# Altium project ActiveElectrod.PrjPcb
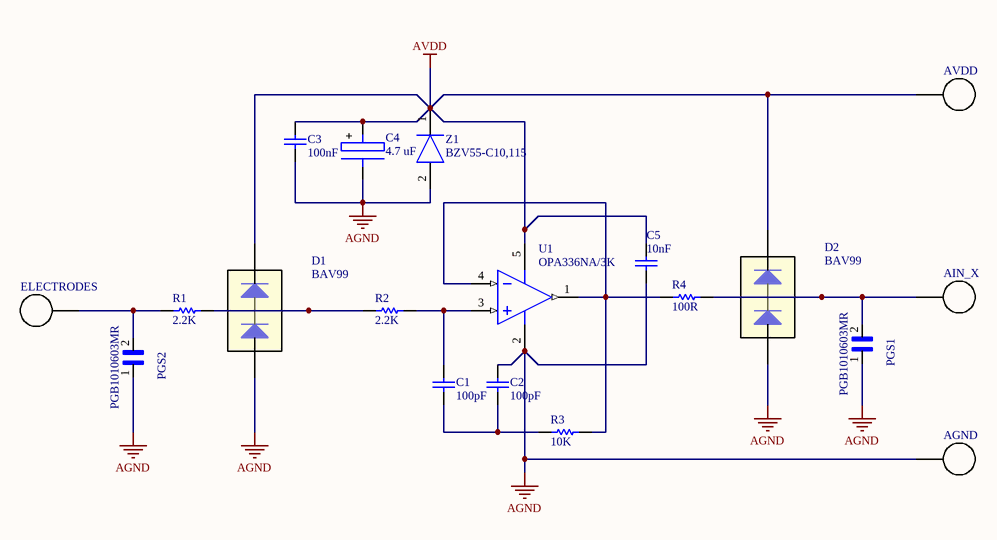
[diagram p0: ActiveElectrod.SchDoc]
1 sheet, 19 parts. Net scope: global (net labels, ports and power ports of the same name join across sheets).
Board file: ActiveElectrod.PcbDoc

## Sheet ActiveElectrod.SchDoc
size A

### Parts
AGND  Test Point 1  [Test Point]  (value not drawn)
AIN_X  Test Point 1  [Test Point]  (value not drawn)
AVDD  Test Point 1  [Test Point]  (value not drawn)
C1  value 100pF  [J1-0603]  (hidden comment: Cap Semi)
C2  value 100pF  [J1-0603]  (hidden comment: Cap Semi)
C3  value 100nF  [J1-0603]  (hidden comment: Cap Semi)
C4  value 4.7 uF  [3528 - Type B]  (hidden comment: Cap polar_Vishay Type B)
C5  value 10nF  [J1-0603]  (hidden comment: Cap Semi)
D1  BAV99  [SOT-23]
D2  BAV99  [SOT-23]
ELECTRODES  Test Point 1  [Test Point]  (value not drawn)
PGS1  PGB1010603MR  [*ESD_PGB1010603MR]
PGS2  PGB1010603MR  [*ESD_PGB1010603MR]
R1  value 2.2K  [J1-0603]  (hidden comment: Res1)
R2  value 2.2K  [J1-0603]  (hidden comment: Res1)
R3  value 10K  [J1-0603]  (hidden comment: Res1)
R4  value 100R  [J1-0603]  (hidden comment: Res1)
U1  OPA336NA/3K  [TI-DBV5_N]
Z1  BZV55-C10,115  [BZV55-C10]

### Nets
AGND: AGND.1 C2.1 C3.1 C4.2 C5.2 D1.1(A) D2.1(A) PGS1.1 PGS2.1 U1.2(V-) Z1.2
AVDD: AVDD.1 C3.2 C4.1 C5.1 D1.2(K) D2.2(K) U1.5(V+) Z1.1
NetAIN_X_1: AIN_X.1 D2.3 PGS1.2 R4.1
NetC1_1: C1.1 R2.1 U1.3(IN+)
NetC1_2: C1.2 C2.2 R3.2
NetD1_3: D1.3 R1.1 R2.2
NetELECTRODES_1: ELECTRODES.1 PGS2.2 R1.2
NetR3_1: R3.1 R4.2 U1.1(OUT) U1.4(IN-)

### Notes on the sheet
- (in symbol Cap polar_Vishay Type B) +

### Library data of the parts
AGND AIN_X AVDD ELECTRODES = Test Point 1: Header, 1-Pin; LatestRevisionDate: 15-Aug-2013; LatestRevisionNote: Re-released for DXP Platform.; Publisher: Sergeev
C1-C3 C5 = Cap Semi: Capacitor (Semiconductor SIM Model); Published: 8-Jun-2000; LatestRevisionDate: 29-May-2009; LatestRevisionNote: IPC-7351 Footprint Added.; PackageReference: C1206; Publisher: Altium Limited; PackageDescription: Chip Capacitor
C4 = Cap polar_Vishay Type B: Capacitor (Model Sergeev); Published: 03-Dec-2010; Publisher: Sergeev
D1 D2 = BAV99: Диодная сборка, 2 диода, катод/анод, 100 V, 125/215 mA, Iобр.=0.5 uA, 4 ns; Разработал: Сергеев; Как подключать: 1 - плюс. 2 - минус.; купить: http://chip-nn.ru/44.php; Datasheet: http://chip-nn.ru/doc/diode/bav99/bav99.zip; Data: 27.08.2013
PGS1 PGS2 = PGB1010603MR: PGB1 Series 15 V 63 Bi-Directional Surface Mount PulseGuardВ® ESD Suppressor; MF: Littelfuse Inc.; Package: 0603 Littelfuse; SnapEDA_Link: https://www.snapeda.com/parts/PGB1010603MR/Littelfuse%20Inc./view-part/?ref=snap; Price: None; MP: PGB1010603MR; Availability: Unavailable; Value: *
R1-R4 = Res1: Resistor; Published: 8-Jun-2000; LatestRevisionDate: 17-Jul-2002; LatestRevisionNote: Re-released for DXP Platform.; PackageReference: AXIAL-0.3; Publisher: Altium Limited; PackageDescription: Axial Device, Thru-Hole; 2 Leads; 0.3 in Pin Spacing
U1 = OPA336NA/3K: Single-Supply, MicroPower CMOS Operational Amplifier MicroAmplifier(TM) Series, 2.3 to 5.5 V, -55 to 125 degC, 5-pin SOT23 (DBV5), Green (RoHS & no Sb/Br); Manufacturer: Texas Instruments; CMRR(Min)(dB): 76; IIB(Max)(pA): 10; Iq per channel(Max)(mA): 0.032; Number of Channels: 1; Offset Drift(Typ)(uV/C): 1.5; Slew Rate(Typ)(V/us): 0.03; Sub Family: Low Input Bias Current Amp (<=10pA), Low Offset Voltage Amplifier (<=500uV), Low Power Amp (<=500uA), Low Supply Voltage Amplifier (<=2.7V), Precision Amplifier; Total Supply Voltage(Max)(+5V is 5, +/-5V is 10): 5.5; Total Supply Voltage(Min)(+5V is 5, +/-5V is 10): 2.3; Vio (25C)(Max)(mV): 0.5; Vn at 1kHz(Typ)(nV/rtHz): 40; DatasheetVersion: SBOS068C; PackageVersion: 4073253-4/K, 03/2006; PackageReference: DBV5; PackageDescription: 5-Pin Plastic Small Outline, Body 1.6 x 2.9 mm, Pitch 0.95 mm; Supplier 1: Digi-Key; Supplier Part Number 1: 296-26272-2-ND; Supplier 2: Digi-Key; Supplier Part Number 2: 296-26272-1-ND; Supplier 3: Digi-Key; Supplier Part Number 3: 296-26272-6-ND; Supplier 4: Newark; Supplier Part Number 4: 75C4843; Supplier 5: Mouser; Supplier Part Number 5: 595-OPA336NA/3K; Eco-Plan: Green (RoHS & no Sb/Br); Mounting Technology: Surface Mount; Code_JEDEC: MO-178; PartNumber: OPA336NA/3K; ComponentLink1Description: Manufacturer URL; ComponentLink1URL: http://www.ti.com/; ComponentLink2Description: Datasheet; ComponentLink2URL: http://www.ti.com/general/docs/lit/getliterature.tsp?genericPartNumber=OPA336&fileType=pdf; ComponentLink3Description: Package Specification; ComponentLink3URL: http://www.ti.com/litv/pdf/mpds018i
Z1 = BZV55-C10,115: Diode; Manufacturer_Name: Nexperia; Datasheet Link: http://www.nxp.com/documents/data_sheet/BZV55_SER.pdf; Manufacturer_Part_Number: BZV55-C10,115; Mouser Part Number: 771-BZV55-C10-T/R; Mouser Price/Stock: https://www.mouser.com/Search/Refine.aspx?Keyword=771-BZV55-C10-T%2FR; RS Part Number: 0788508; RS Price/Stock: http://uk.rs-online.com/web/p/products/0788508